# Altium project Volta_P0_Single_Port.PrjPcb (part 3 of 3)

## Sheet Fuel_Gauge.SchDoc
size A4
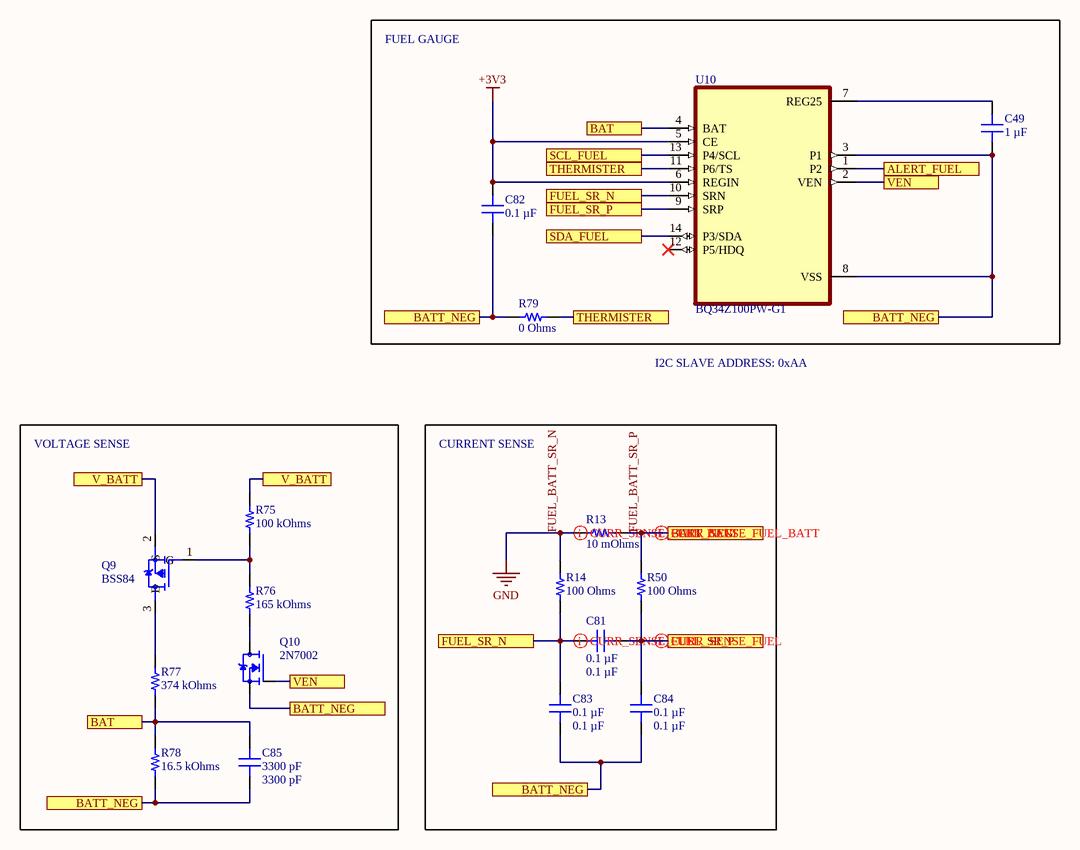
[diagram p4: Fuel_Gauge.SchDoc]

### Parts
C49  1 µF  [CAP 0402_1005]
C81  0.1 µF  [CAP 0603_1608]
C82  0.1 µF  [CAP 0402_1005]
C83  0.1 µF  [CAP 0603_1608]
C84  0.1 µF  [CAP 0603_1608]
C85  3300 pF  [CAP 0402_1005]
Q9  BSS84  [SOT95P240X120-3N]
Q10  2N7002  [SOT95P240X111-3N]
R13  10 mOhms  [RES 1210_3225]
R14  100 Ohms  [RES 0603_1608]
R50  100 Ohms  [RES 0603_1608]
R75  100 kOhms  [RES 0402_1005]
R76  165 kOhms  [RES 0402_1005]
R77  374 kOhms  [RES 0402_1005]
R78  16.5 kOhms  [RES 0603_1608]
R79  0 Ohms  [RES 0805_2012]
U10  BQ34Z100PW-G1  [SOP65P640X120-14N]

### Blocks framed on the sheet
FUEL GAUGE: C49 C82 R79 U10
VOLTAGE SENSE: C85 Q9 Q10 R75-R78
CURRENT SENSE: C81 C83 C84 R13 R14 R50

### Ports
ALERT_FUEL, BAT, BATT_NEG, FUEL_SR_N, FUEL_SR_P, SCL_FUEL, SDA_FUEL, THERMISTER, V_BATT, VEN

### Nets
+3V3: C82.2 U10.5(CE) U10.6(REGIN)
FUEL_BATT_SR_N: R13.1 R14.2  [also labelled GND]
ALERT_FUEL: U10.1(P2) ; port ALERT_FUEL
BAT: C85.2 R77.1 R78.2 U10.4(BAT) ; port BAT
FUEL_BATT_SR_P: C49.1 C82.1 C83.1 C84.1 C85.1 Q10.2(S) R13.2 R50.2 R78.1 R79.1 U10.3(P1) U10.8(VSS) ; port BATT_NEG
FUEL_SR_N: C81.2 C83.2 R14.1 U10.10(SRN) ; port FUEL_SR_N
FUEL_SR_P: C81.1 C84.2 R50.1 U10.9(SRP) ; port FUEL_SR_P
I2CS_SCL: U10.13(P4/SCL) ; port SCL_FUEL
I2CS_SDA: U10.14(P3/SDA) ; port SDA_FUEL
THERMISTER: R79.2 U10.11(P6/TS) ; port THERMISTER
V_BATT: Q9.2(S) R75.2 ; port V_BATT
VEN: Q10.1(G) U10.2(VEN) ; port VEN
NetC49_2: C49.2 U10.7(REG25)
NetQ9_1: Q9.1(G) R75.1 R76.2
NetQ9_3: Q9.3(D) R77.2
NetQ10_3: Q10.3(D) R76.1

Not connected (* = marked no-connect by the designer): U10 12(P5/HDQ)*

### Layout directives
differential pair; differential pair class CURR_SENSE_FUEL_BATT: FUEL_BATT_SR_N, FUEL_BATT_SR_P
differential pair; differential pair class CURR_SENSE_FUEL: FUEL_SR_N, FUEL_SR_P

### Notes on the sheet
- I2C SLAVE ADDRESS: 0xAA

### Library data of the parts
C49 = LMK105BJ105KPLF: CAP CER 1UF 10V X5R 0402; manufacturer: Taiyo Yuden; Tolerance: ±10%; Part Number: LMK105BJ105KPLF; Value: 1 µF; Applications: SMPS Filtering; Capacitance: 1 µF; componentlink1description: Datasheet; componentlink1url: https://ds.yuden.co.jp/TYCOMPAS/ut/detail?pn=LMK105BJ105KPLF &u=M; componentlink2description: DigiKey Link; componentlink2url: https://www.digikey.com/en/products/detail/taiyo-yuden/LMK105BJ105KPLF/7403744; Device Package: 0402 (1005 Metric); lastupdated: 9/08/2022 12:01:16 PM; Lifecycle Status: Active; Minimum Order: 1; Mounting Type: Surface Mount, MLCC; Operating Temperature: -55°C ~ 85°C; Package / Case: 0402 (1005 Metric); packaging: TapeAndReel; partid: 2328; Part Status: Active; price: 0.02; series: M; Size / Dimension: 0.039" L x 0.020" W (1.00mm x 0.50mm); Supplier 1: DigiKey; Supplier Part Number 1: 587-6274-1-ND; Temperature Coefficient: X5R; Thickness (Max): 0.026" (0.65mm); Voltage - Rated: 10V
C81 C83 C84 = C0603C104K5RAC7411: CAP CER 0.1UF 50V X7R 0603; manufacturer: KEMET; Tolerance: ±10%; Part Number: C0603C104K5RAC7411; Value: 0.1 µF; Applications: Bypass, Decoupling; Capacitance: 0.1 µF; componentlink1description: Datasheet; componentlink1url: https://api.kemet.com/component-edge/download/datasheet/C0603C104K5RAC7411.pdf; componentlink2description: DigiKey Link; componentlink2url: https://www.digikey.com/en/products/detail/kemet/C0603C104K5RAC7411/3317013; Device Package: 0603 (1608 Metric); lastupdated: 11/07/2023 7:07:50 PM; Lifecycle Status: Active; Minimum Order: 1; Mounting Type: Surface Mount, MLCC; Operating Temperature: -55°C ~ 125°C; Package / Case: 0603 (1608 Metric); packaging: TapeAndReel; partid: 2233; Part Status: Active; price: 0.01; series: SMD Comm X7R; Size / Dimension: 0.063" L x 0.031" W (1.60mm x 0.80mm); Supplier 1: DigiKey; Supplier Part Number 1: 399-C0603C104K5RAC7411CT-ND; Temperature Coefficient: X7R; Thickness (Max): 0.035" (0.90mm); Voltage - Rated: 50V
C82 = LMK105BJ104MC-F: CAP CER 0.1UF 10V X5R 0402; manufacturer: Taiyo Yuden; Tolerance: ±20%; Part Number: LMK105BJ104MC-F; Value: 0.1 µF; Applications: SMPS Filtering; Capacitance: 0.1 µF; componentlink1description: Datasheet; componentlink1url: https://www.yuden.co.jp/productdata/catalog/mlcc01_e.pdf; componentlink2description: DigiKey Link; componentlink2url: https://www.digikey.com/en/products/detail/taiyo-yuden/LMK105BJ104MC-F/6035743; Device Package: 0402 (1005 Metric); lastupdated: 9/08/2022 12:01:16 PM; Lifecycle Status: Active; Minimum Order: 1; Mounting Type: Surface Mount, MLCC; Operating Temperature: -55°C ~ 85°C; Package / Case: 0402 (1005 Metric); packaging: TapeAndReel; partid: 2414; Part Status: Active; price: 0.03; series: M; Size / Dimension: 0.039" L x 0.020" W (1.00mm x 0.50mm); Supplier 1: DigiKey; Supplier Part Number 1: 587-4572-1-ND; Temperature Coefficient: X5R; Thickness (Max): 0.009" (0.22mm); Voltage - Rated: 10V
C85 = AC0402KRX7R7BB332: CAP CER 3300PF 16V X7R 0402; manufacturer: Yageo; Tolerance: ±10%; Part Number: AC0402KRX7R7BB332; Value: 3300 pF; Applications: Automotive; Capacitance: 3300 pF; componentlink1description: Datasheet; componentlink1url: http://www.yageo.com/documents/recent/UPY-AC_NP0X7R_16V-to-630V_12.pdf; componentlink2description: DigiKey Link; componentlink2url: https://www.digikey.com/en/products/detail/yageo/AC0402KRX7R7BB332/6643254; Device Package: 0402 (1005 Metric); lastupdated: 11/07/2023 7:03:47 PM; Lifecycle Status: Active; Minimum Order: 1; Mounting Type: Surface Mount, MLCC; Operating Temperature: -55°C ~ 125°C; Package / Case: 0402 (1005 Metric); packaging: TapeAndReel; partid: 1886; Part Status: Active; price: 0.01; Ratings: AEC-Q200; series: AC; Size / Dimension: 0.039" L x 0.020" W (1.00mm x 0.50mm); Supplier 1: DigiKey; Supplier Part Number 1: 311-3268-1-ND; Temperature Coefficient: X7R; Thickness (Max): 0.022" (0.55mm); Voltage - Rated: 16V
Q9 = BSS84: BSS84 Series 50 V 10 Ohms P-Ch Enhancement Mode Field Effect Transistor SOT-23-3; MF: {'manufacturer': u'ON Semiconductor'}; Package: None; Price: None; Value: *; MP: BSS84; Availability: Unavailable
Q10 = 2N7002: N-Channel 60V 280mA (Ta) 350mW (Ta) Surface Mount SOT-23-3 (TO-236); MF: {'manufacturer': u'NTE Electronics, Inc'}; Package: None; Price: None; Value: *; MP: 2N7002; Availability: Unavailable
R13 = RL1210FR-070R01L: RES 0.01 OHM 1% 1/2W 1210; Manufacturer: Yageo; Power (Watts): 0.5W, 1/2W; Temperature Coefficient: ±1500ppm/°C; Part Number: RL1210FR-070R01L; ComponentLink1Description: Datasheet; ComponentLink1URL: http://www.yageo.com/documents/recent/PYu-RL_Group_521_RoHS_L_2.pdf; ComponentLink2Description: DigiKey Link; ComponentLink2URL: https://www.digikey.com/en/products/detail/yageo/RL1210FR-070R01L/3886087; Composition: Thick Film; Device Package: 1210 (3225 Metric); Features: Automotive AEC-Q200, Current Sense, Moisture Resistant; Height - Seated (Max): 0.026" (0.65mm); LastUpdated: 12/07/2023 8:34:03 PM; Lifecycle Status: Active; Minimum Order: 1; Number of Terminations: 2; Operating Temperature: -55°C ~ 155°C; Package / Case: 1210 (3225 Metric); Packaging: TapeAndReel; Part Status: Active; Price: 0.11; Ratings: AEC-Q200; Resistance: 10 mOhms; Series: RL; Size / Dimension: 0.122" L x 0.102" W (3.10mm x 2.60mm); Supplier 1: DigiKey; Supplier Part Number 1: 311-0.01NACT-ND; Supplier Device Package: 1210; Tolerance: ±1%; Value: 10 mOhms
R14 R50 = ERA-3AEB101V: RES SMD 100 OHM 0.1% 1/10W 0603; Manufacturer: Panasonic Electronic Components; Power (Watts): 0.1W, 1/10W; Temperature Coefficient: ±25ppm/°C; Part Number: ERA-3AEB101V; Value: 100 Ohms; ComponentLink1Description: Datasheet; ComponentLink1URL: https://industrial.panasonic.com/cdbs/www-data/pdf/RDM0000/AOA0000C307.pdf; ComponentLink2Description: DigiKey Link; ComponentLink2URL: https://www.digikey.com/en/products/detail/panasonic-electronic-components/ERA-3AEB101V/1465830; Composition: Thin Film; Device Package: 0603 (1608 Metric); Features: Automotive AEC-Q200; Height - Seated (Max): 0.022" (0.55mm); LastUpdated: 11/07/2023 7:34:29 PM; Lifecycle Status: Active; Minimum Order: 1; Number of Terminations: 2; Operating Temperature: -55°C ~ 155°C; Package / Case: 0603 (1608 Metric); Packaging: TapeAndReel; PartId: 5523; Part Status: Active; Price: 0.03; Ratings: AEC-Q200; Resistance: 100 Ohms; Series: ERA-3A; Size / Dimension: 0.063" L x 0.031" W (1.60mm x 0.80mm); Supplier 1: DigiKey; Supplier Part Number 1: P100DBCT-ND; Supplier Device Package: 0603; Tolerance: ±0.1%
R75 = RP73PF1E100KBTD: RES 100K OHM 0.1% 1/10W 0402; Manufacturer: TE Connectivity Passive Product; Power (Watts): 0.1W, 1/10W; Temperature Coefficient: ±25ppm/°C; Part Number: RP73PF1E100KBTD; Value: 100 kOhms; ComponentLink1Description: Datasheet; ComponentLink1URL: https://www.te.com/commerce/DocumentDelivery/DDEController?Action=srchrtrv&DocNm=1773272&DocType=DS&DocLang=English; ComponentLink2Description: DigiKey Link; ComponentLink2URL: https://www.digikey.com/en/products/detail/te-connectivity-passive-product/RP73PF1E100KBTD/8261053; Composition: Thin Film; Device Package: 0402 (1005 Metric); Height - Seated (Max): 0.014" (0.35mm); LastUpdated: 12/07/2023 7:24:29 PM; Lifecycle Status: Active; Minimum Order: 1; Number of Terminations: 2; Operating Temperature: -55°C ~ 155°C; Package / Case: 0402 (1005 Metric); Packaging: TapeAndReel; PartId: 2436; Part Status: Active; Price: 0.08; Resistance: 100 kOhms; Series: RP73, Holsworthy; Size / Dimension: 0.039" L x 0.020" W (1.00mm x 0.50mm); Supplier 1: DigiKey; Supplier Part Number 1: A127511CT-ND; Supplier Device Package: 0402; Tolerance: ±0.1%
R76 = RP73PF1E165KBTD: RES 165K OHM 0.1% 1/10W 0402; Manufacturer: TE Connectivity Passive Product; Power (Watts): 0.1W, 1/10W; Temperature Coefficient: ±25ppm/°C; Part Number: RP73PF1E165KBTD; Value: 165 kOhms; ComponentLink1Description: Datasheet; ComponentLink1URL: https://www.te.com/commerce/DocumentDelivery/DDEController?Action=srchrtrv&DocNm=1773272&DocType=DS&DocLang=English; ComponentLink2Description: DigiKey Link; ComponentLink2URL: https://www.digikey.com/en/products/detail/te-connectivity-passive-product/RP73PF1E165KBTD/8261074; Composition: Thin Film; Device Package: 0402 (1005 Metric); Height - Seated (Max): 0.014" (0.35mm); LastUpdated: 12/07/2023 7:24:29 PM; Lifecycle Status: Active; Minimum Order: 1; Number of Terminations: 2; Operating Temperature: -55°C ~ 155°C; Package / Case: 0402 (1005 Metric); Packaging: TapeAndReel; PartId: 2420; Part Status: Active; Price: 0.08; Resistance: 165 kOhms; Series: RP73, Holsworthy; Size / Dimension: 0.039" L x 0.020" W (1.00mm x 0.50mm); Supplier 1: DigiKey; Supplier Part Number 1: A127532CT-ND; Supplier Device Package: 0402; Tolerance: ±0.1%
R77 = ERJ-2RKF3743X: RES SMD 374K OHM 1% 1/10W 0402; Manufacturer: Panasonic Electronic Components; Power (Watts): 0.1W, 1/10W; Temperature Coefficient: ±100ppm/°C; Part Number: ERJ-2RKF3743X; Value: 374 kOhms; ComponentLink1Description: Datasheet; ComponentLink1URL: https://industrial.panasonic.com/cdbs/www-data/pdf/RDA0000/AOA0000C304.pdf; ComponentLink2Description: DigiKey Link; ComponentLink2URL: https://www.digikey.com/en/products/detail/panasonic-electronic-components/ERJ-2RKF3743X/192327; Composition: Thick Film; Device Package: 0402 (1005 Metric); Features: Automotive AEC-Q200; Height - Seated (Max): 0.016" (0.40mm); LastUpdated: 12/07/2023 7:24:13 PM; Lifecycle Status: Active; Minimum Order: 1; Number of Terminations: 2; Operating Temperature: -55°C ~ 155°C; Package / Case: 0402 (1005 Metric); Packaging: CutTape; PartId: 6416; Part Status: Active; Price: 0.01; Ratings: AEC-Q200; Resistance: 374 kOhms; Series: ERJ-2RK; Size / Dimension: 0.039" L x 0.020" W (1.00mm x 0.50mm); Supplier 1: DigiKey; Supplier Part Number 1: P374KLCT-ND; Supplier Device Package: 0402; Tolerance: ±1%
R78 = 1-2176089-8: RES SMD 16.5K OHM 0.1% 1/6W 0603; Manufacturer: TE Connectivity Passive Product; Power (Watts): 0.167W, 1/6W; Temperature Coefficient: ±25ppm/°C; Part Number: 1-2176089-8; Value: 16.5 kOhms; ComponentLink1Description: Datasheet; ComponentLink1URL: https://www.te.com/commerce/DocumentDelivery/DDEController?Action=srchrtrv&DocNm=1773272&DocType=DS&DocLang=English; ComponentLink2Description: DigiKey Link; ComponentLink2URL: https://www.digikey.com/en/products/detail/te-connectivity-passive-product/1-2176089-8/4033693; Composition: Thin Film; Device Package: 0603 (1608 Metric); Height - Seated (Max): 0.022" (0.55mm); LastUpdated: 11/07/2023 7:34:02 PM; Lifecycle Status: Active; Minimum Order: 1; Number of Terminations: 2; Operating Temperature: -55°C ~ 155°C; Package / Case: 0603 (1608 Metric); Packaging: TapeAndReel; PartId: 11782; Part Status: Active; Price: 0.14; Resistance: 16.5 kOhms; Series: RP73P, Holsworthy; Size / Dimension: 0.061" L x 0.031" W (1.55mm x 0.80mm); Supplier 1: DigiKey; Supplier Part Number 1: A110225CT-ND; Supplier Device Package: 0603; Tolerance: ±0.1%
R79 = JR0805X35E: 0805 35 AMP JUMPER; Manufacturer: Ohmite; Power (Watts): 0.245W; Part Number: JR0805X35E; Value: 0 Ohms; ComponentLink1Description: Datasheet; ComponentLink1URL: https://www.ohmite.com/assets/docs/res_jr.pdf?r=false; ComponentLink2Description: DigiKey Link; ComponentLink2URL: https://www.digikey.com/en/products/detail/ohmite/JR0805X35E/10233372; Composition: Metal Element; Device Package: 0805 (2012 Metric); Height - Seated (Max): 0.022" (0.55mm); LastUpdated: 12/07/2023 7:52:18 PM; Lifecycle Status: Active; Minimum Order: 1; Number of Terminations: 2; Operating Temperature: -55°C ~ 150°C; Package / Case: 0805 (2012 Metric); Packaging: TapeAndReel; PartId: 29311; Part Status: Active; Price: 0.10; Resistance: 0 Ohms; Series: JR; Size / Dimension: 0.079" L x 0.049" W (2.00mm x 1.25mm); Supplier 1: DigiKey; Supplier Part Number 1: JR0805X35ECT-ND; Supplier Device Package: 0805; Tolerance: Jumper
U10 = BQ34Z100PW-G1: MF: {'manufacturer': u'Texas Instruments'}; Package: None; Price: None; Value: *; MP: BQ34Z100PW-G1; Availability: Unavailable

## Sheet Voltage_Regulation_TI.SchDoc
size A4
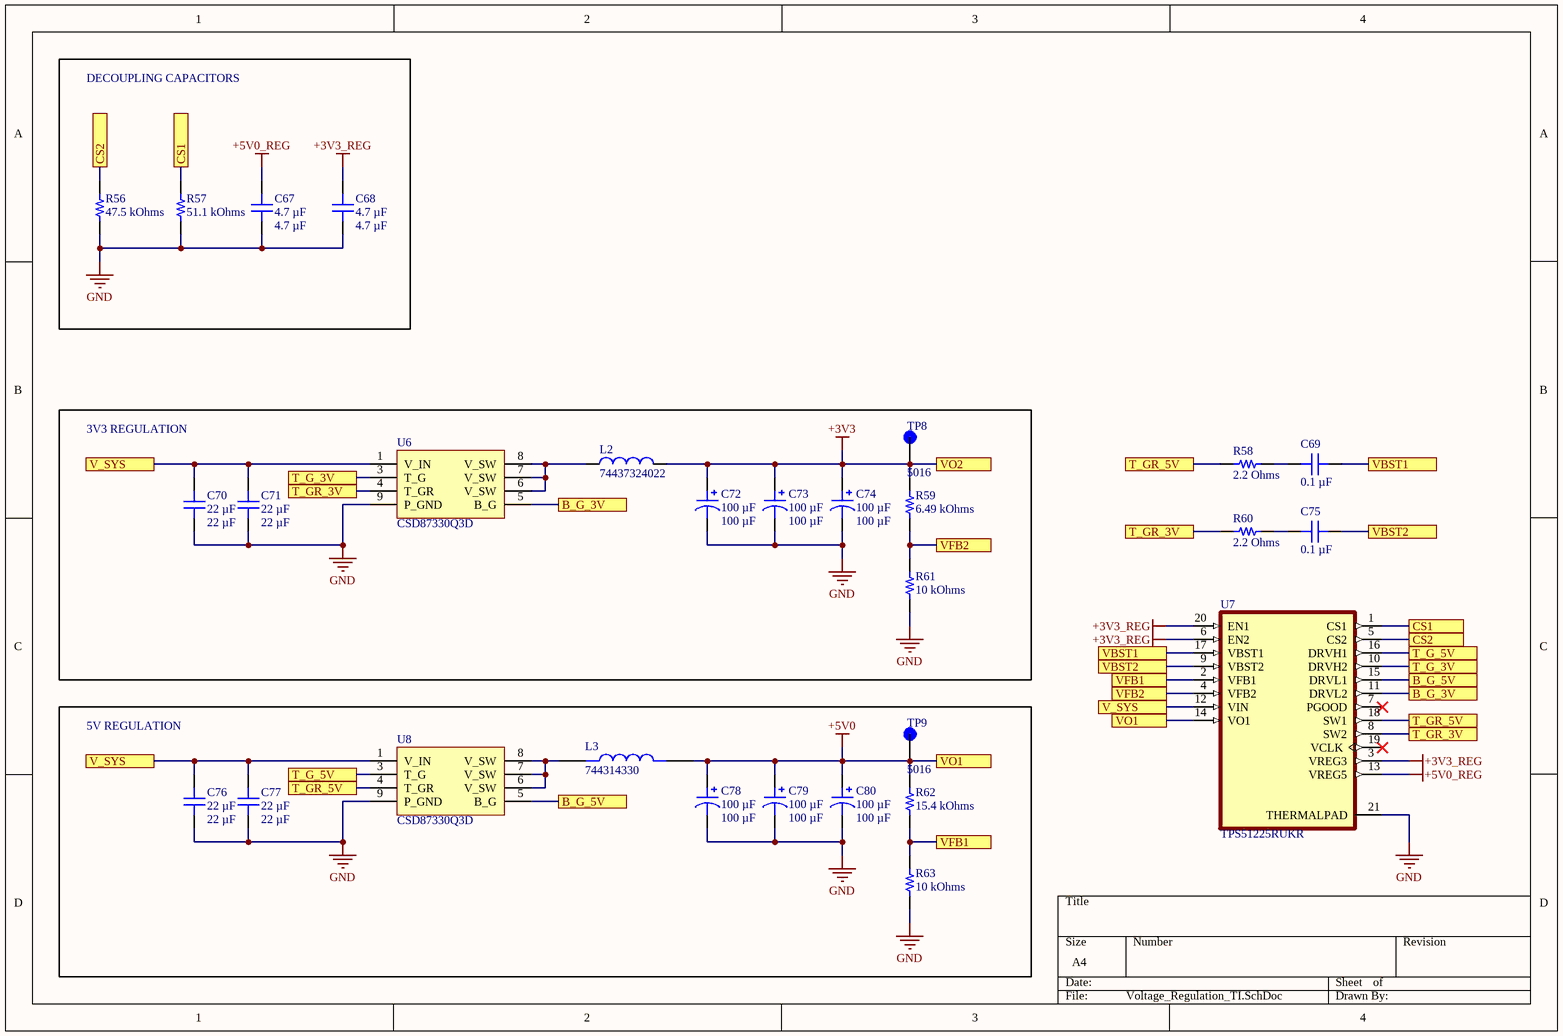
[diagram p5: Voltage_Regulation_TI.SchDoc]

### Parts
C67  4.7 µF  [CAP 0402_1005]
C68  4.7 µF  [CAP 0402_1005]
C69  0.1 µF  [CAP 0402_1005]
C70  22 µF  [CAP 0805_2012]
C71  22 µF  [CAP 0805_2012]
C72  100 µF  [CAP POL 1411_3528]
C73  100 µF  [CAP POL 1411_3528]
C74  100 µF  [CAP POL 1411_3528]
C75  0.1 µF  [CAP 0402_1005]
C76  22 µF  [CAP 0805_2012]
C77  22 µF  [CAP 0805_2012]
C78  100 µF  [CAP POL 1411_3528]
C79  100 µF  [CAP POL 1411_3528]
C80  100 µF  [CAP POL 1411_3528]
L2  74437324022  [IND_74437324022]
L3  744314330  [IND_744314330]
R56  47.5 kOhms  [RES 0402_1005]
R57  51.1 kOhms  [RES 0402_1005]
R58  2.2 Ohms  [RES 0402_1005]
R59  6.49 kOhms  [RES 0402_1005]
R60  2.2 Ohms  [RES 0402_1005]
R61  10 kOhms  [RES 0402_1005]
R62  15.4 kOhms  [RES 0402_1005]
R63  10 kOhms  [RES 0402_1005]
TP8  5016  [KEYSTONE_5016]  (no BOM)
TP9  5016  [KEYSTONE_5016]  (no BOM)
U6  CSD87330Q3D  [Q3D]
U7  TPS51225RUKR  [QFN40P300X300X80-21N]
U8  CSD87330Q3D  [Q3D]

### Blocks framed on the sheet
DECOUPLING CAPACITORS: C67 C68 R56 R57
3V3 REGULATION: C70-C74 L2 R59 R61 TP8 U6
5V REGULATION: C76-C80 L3 R62 R63 TP9 U8

### Ports
B_G_3V, B_G_5V, CS1, CS2, T_G_3V, T_G_5V, T_GR_3V, T_GR_5V, V_SYS, VBST1, VBST2, VFB1, VFB2, VO1, VO2

### Nets
+3V3: C72.1 C73.1 C74.1 L2.2 R59.2 TP8.TP ; port VO2
+3V3_REG: C68.2 U7.3(VREG3) U7.6(EN2) U7.20(EN1)
+5V0: C78.1 C79.1 C80.1 L3.2 R62.2 TP9.TP U7.14(VO1) ; port VO1
+5V0_REG: C67.2 U7.13(VREG5)
GND: C67.1 C68.1 C70.1 C71.1 C72.2 C73.2 C74.2 C76.1 C77.1 C78.2 C79.2 C80.2 R56.1 R57.1 R61.2 R63.2 U6.9(P_GND) U7.21(THERMALPAD) U8.9(P_GND)  [project net FUEL_BATT_SR_N]
B_G_3V: U6.5(B_G) U7.11(DRVL2) ; port B_G_3V
B_G_5V: U7.15(DRVL1) U8.5(B_G) ; port B_G_5V
CS1: R57.2 U7.1(CS1) ; port CS1
CS2: R56.2 U7.5(CS2) ; port CS2
T_G_3V: U6.3(T_G) U7.10(DRVH2) ; port T_G_3V
T_G_5V: U7.16(DRVH1) U8.3(T_G) ; port T_G_5V
T_GR_3V: R60.1 U6.4(T_GR) U7.8(SW2) ; port T_GR_3V
T_GR_5V: R58.1 U7.18(SW1) U8.4(T_GR) ; port T_GR_5V
V_SYS: C70.2 C71.2 C76.2 C77.2 U6.1(V_IN) U7.12(VIN) U8.1(V_IN) ; port V_SYS
VBST1: C69.1 U7.17(VBST1) ; port VBST1
VBST2: C75.1 U7.9(VBST2) ; port VBST2
VFB1: R62.1 R63.1 U7.2(VFB1) ; port VFB1
VFB2: R59.1 R61.1 U7.4(VFB2) ; port VFB2
NetC69_2: C69.2 R58.2
NetC75_2: C75.2 R60.2
NetL2_1: L2.1 U6.6(V_SW) U6.7(V_SW) U6.8(V_SW)
NetL3_1: L3.1 U8.6(V_SW) U8.7(V_SW) U8.8(V_SW)

Not connected (* = marked no-connect by the designer): U7 7(PGOOD)* 19(VCLK)*

### Library data of the parts
C67 C68 = CL05A475MO5NUNC: CAP CER 4.7UF 16V X5R 0402; manufacturer: Samsung Electro-Mechanics; Tolerance: ±20%; Part Number: CL05A475MO5NUNC; Value: 4.7 µF; Applications: General Purpose; Capacitance: 4.7 µF; componentlink1description: Datasheet; componentlink1url: http://www.samsungsem.com/kr/support/product-search/mlcc/__icsFiles/afieldfile/2019/05/29/Data%20sheet_CL05A475MO5NUNC.pdf; componentlink2description: DigiKey Link; componentlink2url: https://www.digikey.com/en/products/detail/samsung-electro-mechanics/CL05A475MO5NUNC/5961320; Device Package: 0402 (1005 Metric); lastupdated: 27/04/2023 7:05:02 PM; Lifecycle Status: Active; Minimum Order: 1; Mounting Type: Surface Mount, MLCC; Operating Temperature: -55°C ~ 85°C; Package / Case: 0402 (1005 Metric); packaging: TapeAndReel; partid: 1760; Part Status: Active; price: 0.08; series: CL; Size / Dimension: 0.039" L x 0.020" W (1.00mm x 0.50mm); Supplier 1: DigiKey; Supplier Part Number 1: 1276-6836-1-ND; Temperature Coefficient: X5R; Thickness (Max): 0.028" (0.70mm); Voltage - Rated: 16V
C69 C75 = 885012105001: CAP CER 0.1UF 6.3V X5R 0402; manufacturer: Würth Elektronik; Tolerance: ±20%; Part Number: 885012105001; Value: 0.1 µF; Applications: General Purpose; Capacitance: 0.1 µF; componentlink1description: Datasheet; componentlink1url: https://katalog.we-online.de/pbs/datasheet/885012105001.pdf; componentlink2description: DigiKey Link; componentlink2url: https://www.digikey.com/en/products/detail/würth-elektronik/885012105001/5453333; Device Package: 0402 (1005 Metric); lastupdated: 26/04/2023 7:02:37 PM; Lifecycle Status: Active; Minimum Order: 1; Mounting Type: Surface Mount, MLCC; Operating Temperature: -55°C ~ 85°C; Package / Case: 0402 (1005 Metric); packaging: TapeAndReel; partid: 1931; Part Status: Active; price: 0.01; series: WCAP-CSGP; Size / Dimension: 0.039" L x 0.020" W (1.00mm x 0.50mm); Supplier 1: DigiKey; Supplier Part Number 1: 732-7478-1-ND; Temperature Coefficient: X5R; Thickness (Max): 0.022" (0.55mm); Voltage - Rated: 6.3V
C70 C71 C76 C77 = C2012X5R1V226M125AC: CAP CER 22UF 35V X5R 0805; manufacturer: TDK Corporation; Tolerance: ±20%; Part Number: C2012X5R1V226M125AC; Value: 22 µF; Applications: General Purpose; Capacitance: 22 µF; componentlink1description: Datasheet; componentlink1url: https://product.tdk.com/info/en/catalog/datasheets/mlcc_commercial_general_en.pdf?ref_disty=digikey; componentlink2description: DigiKey Link; componentlink2url: https://www.digikey.com/en/products/detail/tdk-corporation/C2012X5R1V226M125AC/3951664; Device Package: 0805 (2012 Metric); Features: Low ESL; lastupdated: 27/04/2023 7:13:26 PM; Lifecycle Status: Active; Minimum Order: 1; Mounting Type: Surface Mount, MLCC; Operating Temperature: -55°C ~ 85°C; Package / Case: 0805 (2012 Metric); packaging: TapeAndReel; partid: 45365; Part Status: Active; price: 0.28; series: C; Size / Dimension: 0.079" L x 0.049" W (2.00mm x 1.25mm); Supplier 1: DigiKey; Supplier Part Number 1: 445-14428-1-ND; Temperature Coefficient: X5R; Thickness (Max): 0.057" (1.45mm); Voltage - Rated: 35V
C72-C74 C78-C80 = ATCC-211B-010-107M-T: CAP TANT 100UF 20% 10V 1411; manufacturer: Abracon LLC; Manufacturer Size Code: B; ESR (Equivalent Series Resistance): 1.5Ohm; Type: Molded; Part Number: ATCC-211B-010-107M-T; Value: 100 µF; Capacitance: 100 µF; componentlink1description: Datasheet; componentlink1url: https://abracon.com/Magnetics/inductors/ATCC-211.pdf; componentlink2description: DigiKey Link; componentlink2url: https://www.digikey.com/en/products/detail/abracon-llc/ATCC-211B-010-107M-T/4245645; Device Package: 1411 (3528 Metric); Features: General Purpose; Height - Seated (Max): 0.083" (2.10mm); lastupdated: 27/04/2023 7:52:12 PM; Lifecycle Status: Active; Minimum Order: 1; Mounting Type: Surface Mount; Operating Temperature: -55°C ~ 125°C; Package / Case: 1411 (3528 Metric); packaging: TapeAndReel; partid: 25; Part Status: Active; price: 0.45; series: ATCC-211; Size / Dimension: 0.138" L x 0.110" W (3.50mm x 2.80mm); Supplier 1: DigiKey; Supplier Part Number 1: ATCC-211B-010-107M-TCT-ND; Tolerance: ±20%; Voltage - Rated: 10 V
L2 = 74437324022: LHMI Inductor 4020 2.2uH 5.0A 27.0mOhm; MF: {'manufacturer': u'W\xfcrth Elektronik'}; Value: 2.2µH; Availability: Unavailable; Price: None; MP: 74437324022; Package: None
L3 = 744314330: Inductor SMD 7050 3.3µH 9 A Wuerth Elektronik WE-HCI 744314330 1 pc(s); MF: {'manufacturer': u'Wurth Electronics'}; MP: 744314330; Value: 3.3µH; Package: None; Price: None; Availability: Unavailable
R56 = RC0402FR-0747K5L: RES 47.5K OHM 1% 1/16W 0402; Manufacturer: Yageo; Power (Watts): 0.063W, 1/16W; Temperature Coefficient: ±100ppm/°C; Part Number: RC0402FR-0747K5L; Value: 47.5 kOhms; ComponentLink1Description: Datasheet; ComponentLink1URL: https://www.yageo.com/upload/media/product/productsearch/datasheet/rchip/PYu-RC_Group_51_RoHS_L_10.pdf; ComponentLink2Description: DigiKey Link; ComponentLink2URL: https://www.digikey.com/en/products/detail/yageo/RC0402FR-0747K5L/726617; Composition: Thick Film; Device Package: 0402 (1005 Metric); Features: Moisture Resistant; Height - Seated (Max): 0.016" (0.40mm); LastUpdated: 27/04/2023 7:26:05 PM; Lifecycle Status: Active; Minimum Order: 1; Number of Terminations: 2; Operating Temperature: -55°C ~ 155°C; Package / Case: 0402 (1005 Metric); Packaging: CutTape; PartId: 2538; Part Status: Active; Price: 0.01; Resistance: 47.5 kOhms; Series: RC_L; Size / Dimension: 0.039" L x 0.020" W (1.00mm x 0.50mm); Supplier 1: DigiKey; Supplier Part Number 1: 311-47.5KLRCT-ND; Supplier Device Package: 0402; Tolerance: ±1%
R57 = CR0402-FX-5112GLF: RES SMD 51.1K OHM 1% 1/16W 0402; Manufacturer: Bourns Inc.; Power (Watts): 0.063W, 1/16W; Temperature Coefficient: ±100ppm/°C; Part Number: CR0402-FX-5112GLF; Value: 51.1 kOhms; ComponentLink1Description: Datasheet; ComponentLink1URL: https://www.bourns.com/docs/Product-Datasheets/CR0402.pdf; ComponentLink2Description: DigiKey Link; ComponentLink2URL: https://www.digikey.com/en/products/detail/bourns-inc/CR0402-FX-5112GLF/3783414; Composition: Thick Film; Device Package: 0402 (1005 Metric); Height - Seated (Max): 0.016" (0.40mm); LastUpdated: 27/04/2023 7:25:58 PM; Lifecycle Status: Active; Minimum Order: 1; Number of Terminations: 2; Operating Temperature: -55°C ~ 155°C; Package / Case: 0402 (1005 Metric); Packaging: CutTape; PartId: 4388; Part Status: Active; Price: 0.01; Resistance: 51.1 kOhms; Series: CR0402; Size / Dimension: 0.039" L x 0.020" W (1.00mm x 0.50mm); Supplier 1: DigiKey; Supplier Part Number 1: CR0402-FX-5112GLFCT-ND; Supplier Device Package: 0402; Tolerance: ±1%
R58 R60 = RC0402JR-072R2L: RES 2.2 OHM 5% 1/16W 0402; Manufacturer: Yageo; Power (Watts): 0.063W, 1/16W; Temperature Coefficient: ±200ppm/°C; Part Number: RC0402JR-072R2L; Value: 2.2 Ohms; ComponentLink1Description: Datasheet; ComponentLink1URL: https://www.yageo.com/upload/media/product/productsearch/datasheet/rchip/PYu-RC_Group_51_RoHS_L_10.pdf; ComponentLink2Description: DigiKey Link; ComponentLink2URL: https://www.digikey.com/en/products/detail/yageo/RC0402JR-072R2L/726435; Composition: Thick Film; Device Package: 0402 (1005 Metric); Features: Moisture Resistant; Height - Seated (Max): 0.016" (0.40mm); LastUpdated: 27/04/2023 7:26:02 PM; Lifecycle Status: Active; Minimum Order: 1; Number of Terminations: 2; Operating Temperature: -55°C ~ 155°C; Package / Case: 0402 (1005 Metric); Packaging: CutTape; PartId: 3413; Part Status: Active; Price: 0.01; Resistance: 2.2 Ohms; Series: RC_L; Size / Dimension: 0.039" L x 0.020" W (1.00mm x 0.50mm); Supplier 1: DigiKey; Supplier Part Number 1: 311-2.2JRCT-ND; Supplier Device Package: 0402; Tolerance: ±5%
R59 = RC0402FR-076K49L: RES 6.49K OHM 1% 1/16W 0402; Manufacturer: Yageo; Power (Watts): 0.063W, 1/16W; Temperature Coefficient: ±100ppm/°C; Part Number: RC0402FR-076K49L; Value: 6.49 kOhms; ComponentLink1Description: Datasheet; ComponentLink1URL: https://www.yageo.com/upload/media/product/productsearch/datasheet/rchip/PYu-RC_Group_51_RoHS_L_10.pdf; ComponentLink2Description: DigiKey Link; ComponentLink2URL: https://www.digikey.com/en/products/detail/yageo/RC0402FR-076K49L/726641; Composition: Thick Film; Device Package: 0402 (1005 Metric); Features: Moisture Resistant; Height - Seated (Max): 0.016" (0.40mm); LastUpdated: 27/04/2023 7:26:05 PM; Lifecycle Status: Active; Minimum Order: 1; Number of Terminations: 2; Operating Temperature: -55°C ~ 155°C; Package / Case: 0402 (1005 Metric); Packaging: CutTape; PartId: 2571; Part Status: Active; Price: 0.01; Resistance: 6.49 kOhms; Series: RC_L; Size / Dimension: 0.039" L x 0.020" W (1.00mm x 0.50mm); Supplier 1: DigiKey; Supplier Part Number 1: 311-6.49KLRCT-ND; Supplier Device Package: 0402; Tolerance: ±1%
R61 R63 = RC0402JR-1310KL: RES 10K OHM 5% 1/16W 0402; Manufacturer: Yageo; Power (Watts): 0.063W, 1/16W; Temperature Coefficient: ±100ppm/°C; Part Number: RC0402JR-1310KL; Value: 10 kOhms; ComponentLink1Description: Datasheet; ComponentLink1URL: https://www.yageo.com/upload/media/product/productsearch/datasheet/rchip/PYu-RC_Group_51_RoHS_L_11.pdf; ComponentLink2Description: DigiKey Link; ComponentLink2URL: https://www.digikey.com/en/products/detail/yageo/RC0402JR-1310KL/13694115; Composition: Thick Film; Device Package: 0402 (1005 Metric); Features: Moisture Resistant; Height - Seated (Max): 0.016" (0.40mm); LastUpdated: 4/04/2023 7:21:31 PM; Lifecycle Status: Active; Minimum Order: 50000; Number of Terminations: 2; Operating Temperature: -55°C ~ 155°C; Package / Case: 0402 (1005 Metric); PartId: 69237; Part Status: Active; Price: 0; Resistance: 10 kOhms; Series: RC_L; Size / Dimension: 0.039" L x 0.020" W (1.00mm x 0.50mm); Supplier 1: DigiKey; Supplier Part Number 1: 13-RC0402JR-1310KLTR-ND; Supplier Device Package: 0402; Tolerance: ±5%
R62 = RC0402FR-0715K4L: RES 15.4K OHM 1% 1/16W 0402; Manufacturer: Yageo; Power (Watts): 0.063W, 1/16W; Temperature Coefficient: ±100ppm/°C; Part Number: RC0402FR-0715K4L; Value: 15.4 kOhms; ComponentLink1Description: Datasheet; ComponentLink1URL: https://www.yageo.com/upload/media/product/productsearch/datasheet/rchip/PYu-RC_Group_51_RoHS_L_10.pdf; ComponentLink2Description: DigiKey Link; ComponentLink2URL: https://www.digikey.com/en/products/detail/yageo/RC0402FR-0715K4L/5280852; Composition: Thick Film; Device Package: 0402 (1005 Metric); Features: Moisture Resistant; Height - Seated (Max): 0.016" (0.40mm); LastUpdated: 27/04/2023 7:26:05 PM; Lifecycle Status: Active; Minimum Order: 1; Number of Terminations: 2; Operating Temperature: -55°C ~ 155°C; Package / Case: 0402 (1005 Metric); Packaging: CutTape; PartId: 2575; Part Status: Active; Price: 0.01; Resistance: 15.4 kOhms; Series: RC_L; Size / Dimension: 0.039" L x 0.020" W (1.00mm x 0.50mm); Supplier 1: DigiKey; Supplier Part Number 1: YAG2992CT-ND; Supplier Device Package: 0402; Tolerance: ±1%
TP8 TP9 = 5016: MF: {'manufacturer': u'Keystone Electronics'}; Package: None; MP: 5016; Value: *; Price: None; Availability: Unavailable
U6 U8 = CSD87330Q3D: Synchronous Buck NexFET™ Power Block
U7 = TPS51225RUKR: MF: {'manufacturer': u'Texas Instruments'}; Package: None; MP: TPS51225RUKR; Value: *; Price: None; Availability: Unavailable

## Sheet I2C.SchDoc
size A4
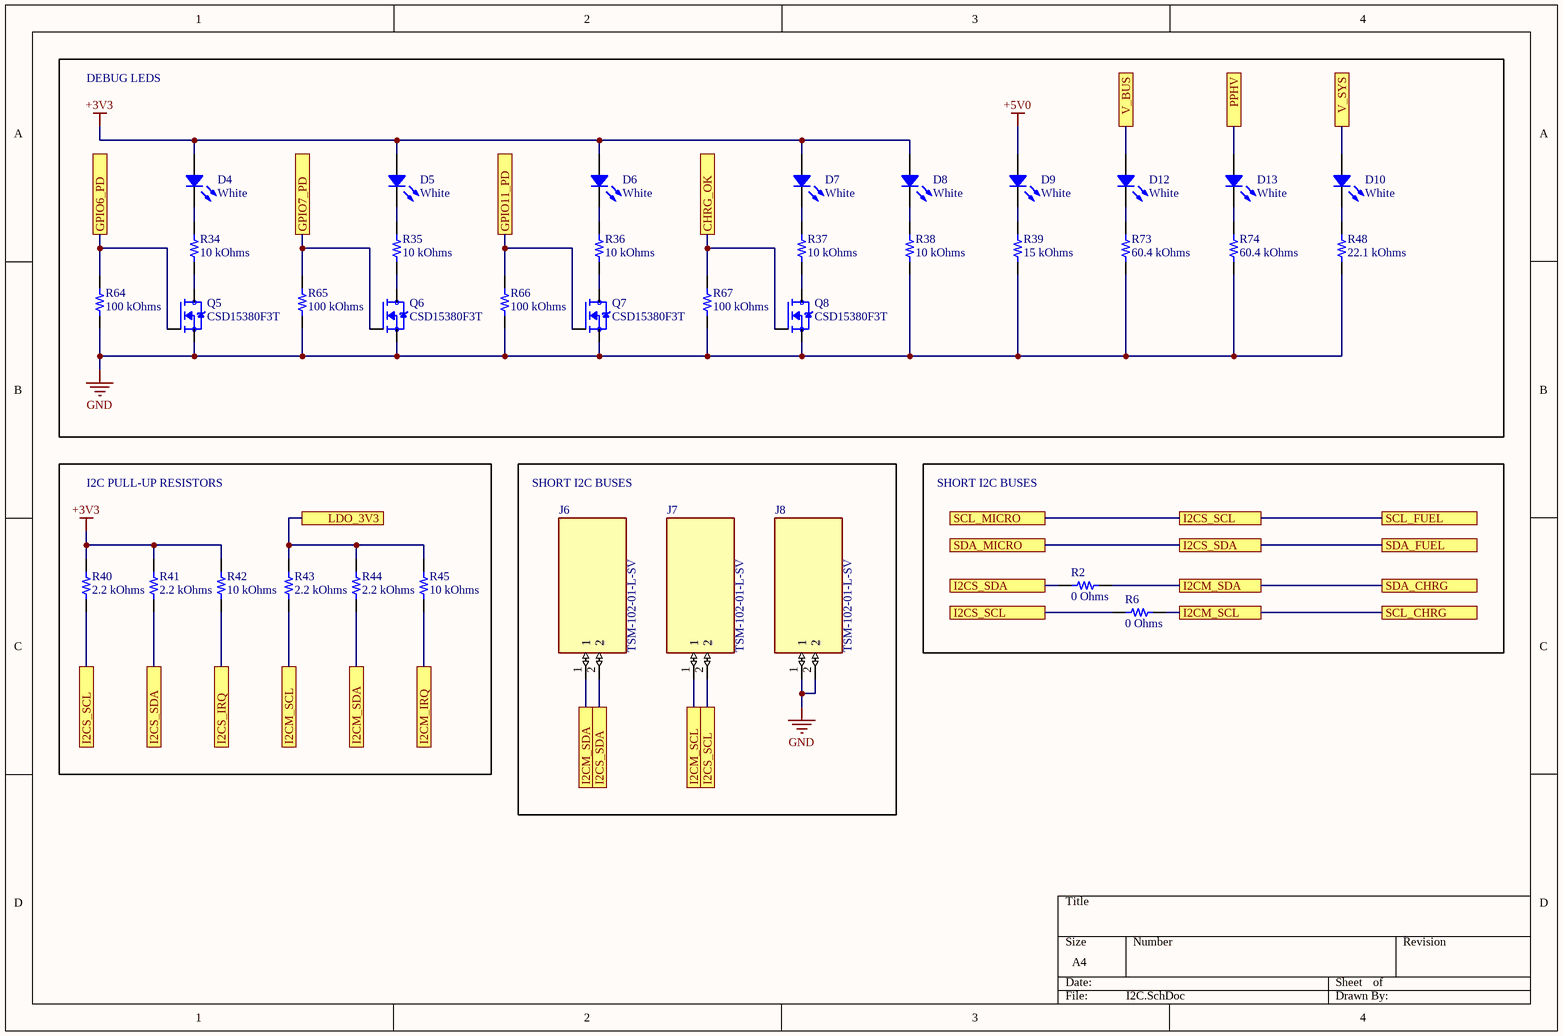
[diagram p6: I2C.SchDoc]

### Parts
D4  White  [LED 0805_2012]  (no BOM)
D5  White  [LED 0805_2012]  (no BOM)
D6  White  [LED 0805_2012]  (no BOM)
D7  White  [LED 0805_2012]  (no BOM)
D8  White  [LED 0805_2012]  (no BOM)
D9  White  [LED 0805_2012]  (no BOM)
D10  White  [LED 0805_2012]  (no BOM)
D12  White  [LED 0805_2012]  (no BOM)
D13  White  [LED 0805_2012]  (no BOM)
J6  TSM-102-01-L-SV  [TSM-102-01-L-SV]  (no BOM)
J7  TSM-102-01-L-SV  [TSM-102-01-L-SV]  (no BOM)
J8  TSM-102-01-L-SV  [TSM-102-01-L-SV]  (no BOM)
Q5  CSD15380F3T  [TRXDFN69X60X35-3N]  (no BOM)
Q6  CSD15380F3T  [TRXDFN69X60X35-3N]  (no BOM)
Q7  CSD15380F3T  [TRXDFN69X60X35-3N]  (no BOM)
Q8  CSD15380F3T  [TRXDFN69X60X35-3N]  (no BOM)
R2  0 Ohms  [RES 0402_1005]
R6  0 Ohms  [RES 0402_1005]
R34  10 kOhms  [RES 0603_1608]  (no BOM)
R35  10 kOhms  [RES 0603_1608]  (no BOM)
R36  10 kOhms  [RES 0603_1608]  (no BOM)
R37  10 kOhms  [RES 0603_1608]  (no BOM)
R38  10 kOhms  [RES 0603_1608]  (no BOM)
R39  15 kOhms  [RES 0402_1005]  (no BOM)
R40  2.2 kOhms  [RES 0402_1005]
R41  2.2 kOhms  [RES 0402_1005]
R42  10 kOhms  [RES 0402_1005]
R43  2.2 kOhms  [RES 0402_1005]
R44  2.2 kOhms  [RES 0402_1005]
R45  10 kOhms  [RES 0402_1005]
R48  22.1 kOhms  [RES 0603_1608]  (no BOM)
R64  100 kOhms  [RES 0402_1005]  (no BOM)
R65  100 kOhms  [RES 0402_1005]  (no BOM)
R66  100 kOhms  [RES 0402_1005]  (no BOM)
R67  100 kOhms  [RES 0402_1005]  (no BOM)
R73  60.4 kOhms  [RES 0603_1608]  (no BOM)
R74  60.4 kOhms  [RES 0603_1608]  (no BOM)

### Blocks framed on the sheet
DEBUG LEDS: D4-D10 D12 D13 Q5-Q8 R34-R39 R48 R64-R67 R73 R74
I2C PULL-UP RESISTORS: R40-R45
SHORT I2C BUSES: J6-J8
SHORT I2C BUSES: R2 R6

### Ports
CHRG_OK, GPIO6_PD, GPIO7_PD, GPIO11_PD, I2CM_IRQ, I2CM_SCL, I2CM_SDA, I2CS_IRQ, I2CS_SCL, I2CS_SDA, LDO_3V3, PPHV, SCL_CHRG, SCL_FUEL, SCL_MICRO, SDA_CHRG, SDA_FUEL, SDA_MICRO, V_BUS, V_SYS

### Nets
+3V3: D4.1 D5.1 D6.1 D7.1 D8.1 R40.2 R41.2 R42.2
+5V0: D9.1
GND: J8.1 J8.2 Q5.2(S) Q6.2(S) Q7.2(S) Q8.2(S) R38.1 R39.1 R48.1 R64.1 R65.1 R66.1 R67.1 R73.1 R74.1  [project net FUEL_BATT_SR_N]
ADCIN1: R43.2 R44.2 R45.2 ; port LDO_3V3
CHRG_OK: Q8.1(G) R67.2 ; port CHRG_OK
GPIO2_M: R42.1 ; port I2CS_IRQ
GPIO6_PD: Q5.1(G) R64.2 ; port GPIO6_PD
GPIO7_PD: Q6.1(G) R65.2 ; port GPIO7_PD
GPIO11_PD: Q7.1(G) R66.2 ; port GPIO11_PD
I2CM_IRQ: R45.1 ; port I2CM_IRQ
I2CM_SCL: J7.1 R6.2 R43.1 ; port SCL_CHRG, port I2CM_SCL
I2CM_SDA: J6.1 R2.2 R44.1 ; port SDA_CHRG, port I2CM_SDA
I2CS_SCL: J7.2 R6.1 R40.1 ; port SCL_MICRO, port I2CS_SCL, port SCL_FUEL
I2CS_SDA: J6.2 R2.1 R41.1 ; port SDA_MICRO, port I2CS_SDA, port SDA_FUEL
PPHV: D13.1 ; port PPHV
V_BUS: D12.1 ; port V_BUS
V_SYS: D10.1 ; port V_SYS
NetD4_2: D4.2 R34.2
NetD5_2: D5.2 R35.2
NetD6_2: D6.2 R36.2
NetD7_2: D7.2 R37.2
NetD8_2: D8.2 R38.2
NetD9_2: D9.2 R39.2
NetD10_2: D10.2 R48.2
NetD12_2: D12.2 R73.2
NetD13_2: D13.2 R74.2
NetQ5_3: Q5.3(D) R34.1
NetQ6_3: Q6.3(D) R35.1
NetQ7_3: Q7.3(D) R36.1
NetQ8_3: Q8.3(D) R37.1

### Library data of the parts
D4-D10 D12 D13 = QBLP631-IW5: 0805 LED WHITE, YELLOW DIFFUSED; Manufacturer: QT Brightek (QTB); Configuration: Standard; Current - Test: 5mA; Lens Size: 1.30mm x 1.25mm; Lens Style: Rectangle with Flat Top; Millicandela Rating: 85mcd; Viewing Angle: 140°; Voltage - Forward (Vf) (Typ): 2.9V; Part Number: QBLP631-IW5; Color: White; ComponentLink1Description: Datasheet; ComponentLink1URL: https://www.qt-brightek.com/datasheet/QBLP631-IW5.pdf; ComponentLink2Description: DigiKey Link; ComponentLink2URL: https://www.digikey.com/en/products/detail/qt-brightek-qtb/QBLP631-IW5/16499651; Device Package: 0805 (2012 Metric); Height (Max): 0.90mm; LastUpdated: 9/08/2022 12:43:05 PM; Lens Color: Yellow; Lens Transparency: Diffused; Lifecycle Status: Active; Minimum Order: 1; Mounting Type: Surface Mount; Package / Case: 0805 (2012 Metric); Packaging: TapeAndReel; PartId: 1097; Part Status: Active; Price: 0.08; Series: QBLP631; Size / Dimension: 2.00mm L x 1.25mm W; Supplier 1: DigiKey; Supplier Part Number 1: 1516-QBLP631-IW5CT-ND; Supplier Device Package: 0805; Value: White
J6-J8 = TSM-102-01-L-SV: MF: {'manufacturer': u'Samtec Inc.'}; Value: *; Package: None; Price: None; MP: TSM-102-01-L-SV; Availability: Unavailable
Q5-Q8 = CSD15380F3T: 20-V N-Channel FemtoFET MOSFET 3-PICOSTAR -55 to 150; MF: {'manufacturer': u'Texas Instruments'}; Value: *; Package: None; Price: None; MP: CSD15380F3T; Availability: Unavailable
R2 R6 = CRCW04020000Z0EDHP: RES SMD 0 OHM JUMPER 1/5W 0402; Manufacturer: Vishay Dale; Power (Watts): 0.2W, 1/5W; Part Number: CRCW04020000Z0EDHP; Value: 0 Ohms; ComponentLink1Description: Datasheet; ComponentLink1URL: http://www.vishay.com/docs/20043/crcwhpe3.pdf; ComponentLink2Description: DigiKey Link; ComponentLink2URL: https://www.digikey.com/en/products/detail/vishay-dale/CRCW04020000Z0EDHP/2222496; Composition: Thick Film; Device Package: 0402 (1005 Metric); Features: Automotive AEC-Q200, Pulse Withstanding; Height - Seated (Max): 0.016" (0.40mm); LastUpdated: 7/09/2023 7:26:17 PM; Lifecycle Status: Active; Minimum Order: 1; Number of Terminations: 2; Operating Temperature: -55°C ~ 155°C; Package / Case: 0402 (1005 Metric); Packaging: TapeAndReel; PartId: 3131; Part Status: Active; Price: 0.01; Ratings: AEC-Q200; Resistance: 0 Ohms; Series: CRCW-HP; Size / Dimension: 0.039" L x 0.020" W (1.00mm x 0.50mm); Supplier 1: DigiKey; Supplier Part Number 1: 541-0.0YBCT-ND; Supplier Device Package: 0402; Tolerance: Jumper
R34-R38 = CR0603-JW-103EAS: RES 10K OHM 5% 0.01W 0603; Manufacturer: Bourns Inc.; Temperature Coefficient: ±200ppm/°C; Part Number: CR0603-JW-103EAS; Value: 10 kOhms; ComponentLink1Description: Datasheet; ComponentLink1URL: https://www.bourns.com/docs/Product-Datasheets/CR0603-AS.pdf; ComponentLink2Description: DigiKey Link; ComponentLink2URL: http://digikey.com/product-detail/en/bourns-inc/CR0603-JW-103EAS/CR0603-JW-103EASCT-ND/6830121; Composition: Thick Film; Device Package: 0603 (1608 Metric); Features: Anti-Sulfur; Height - Seated (Max): 0.024" (0.60mm); LastUpdated: 27/04/2023 7:33:47 PM; Lifecycle Status: Active; Minimum Order: 1; Number of Terminations: 2; Operating Temperature: -55°C ~ 155°C; Package / Case: 0603 (1608 Metric); Packaging: CutTape; PartId: 22277; Part Status: Active; Power (Watts): 0.01W; Price: 0.10; Resistance: 10 kOhms; Series: CR0603-AS; Size / Dimension: 0.063" L x 0.031" W (1.60mm x 0.80mm); Supplier 1: DigiKey; Supplier Part Number 1: CR0603-JW-103EASCT-ND; Supplier Device Package: 0603; Tolerance: ±5%
R39 = RC0402FR-1315KL: RES 15K OHM 1% 1/16W 0402; Manufacturer: Yageo; Power (Watts): 0.063W, 1/16W; Temperature Coefficient: ±100ppm/°C; Part Number: RC0402FR-1315KL; Value: 15 kOhms; ComponentLink1Description: Datasheet; ComponentLink1URL: https://www.yageo.com/upload/media/product/productsearch/datasheet/rchip/PYu-RC_Group_51_RoHS_L_11.pdf; ComponentLink2Description: DigiKey Link; ComponentLink2URL: https://www.digikey.com/en/products/detail/yageo/RC0402FR-1315KL/13694190; Composition: Thick Film; Device Package: 0402 (1005 Metric); Features: Moisture Resistant; Height - Seated (Max): 0.016" (0.40mm); LastUpdated: 14/08/2022 9:22:52 PM; Lifecycle Status: Active; Minimum Order: 50000; Number of Terminations: 2; Operating Temperature: -55°C ~ 155°C; Package / Case: 0402 (1005 Metric); PartId: 65094; Part Status: Active; Price: 0; Resistance: 15 kOhms; Series: RC_L; Size / Dimension: 0.039" L x 0.020" W (1.00mm x 0.50mm); Supplier 1: DigiKey; Supplier Part Number 1: 13-RC0402FR-1315KLTR-ND; Supplier Device Package: 0402; Tolerance: ±1%
R40 R41 R43 R44 = RC0402FR-132K2L: RES 2.2K OHM 1% 1/16W 0402; Manufacturer: Yageo; Power (Watts): 0.063W, 1/16W; Temperature Coefficient: ±100ppm/°C; Part Number: RC0402FR-132K2L; Value: 2.2 kOhms; ComponentLink1Description: Datasheet; ComponentLink1URL: https://www.yageo.com/upload/media/product/productsearch/datasheet/rchip/PYu-RC_Group_51_RoHS_L_11.pdf; ComponentLink2Description: DigiKey Link; ComponentLink2URL: https://www.digikey.com/en/products/detail/yageo/RC0402FR-132K2L/13694070; Composition: Thick Film; Device Package: 0402 (1005 Metric); Features: Moisture Resistant; Height - Seated (Max): 0.016" (0.40mm); LastUpdated: 26/04/2023 7:19:35 PM; Lifecycle Status: Active; Minimum Order: 50000; Number of Terminations: 2; Operating Temperature: -55°C ~ 155°C; Package / Case: 0402 (1005 Metric); PartId: 64946; Part Status: Active; Price: 0; Resistance: 2.2 kOhms; Series: RC_L; Size / Dimension: 0.039" L x 0.020" W (1.00mm x 0.50mm); Supplier 1: DigiKey; Supplier Part Number 1: 13-RC0402FR-132K2LTR-ND; Supplier Device Package: 0402; Tolerance: ±1%
R42 R45 = RC0402JR-1310KL: as R61 on sheet Voltage_Regulation_TI; Part Number: RC0402JR-1310KL; Value: 10 kOhms; ComponentLink1Description: Datasheet; ComponentLink1URL: https://www.yageo.com/upload/media/product/productsearch/datasheet/rchip/PYu-RC_Group_51_RoHS_L_11.pdf; ComponentLink2Description: DigiKey Link; ComponentLink2URL: https://www.digikey.com/en/products/detail/yageo/RC0402JR-1310KL/13694115; Composition: Thick Film; Device Package: 0402 (1005 Metric); Features: Moisture Resistant; Height - Seated (Max): 0.016" (0.40mm); LastUpdated: 4/04/2023 7:21:31 PM; Lifecycle Status: Active; Minimum Order: 50000; Number of Terminations: 2; Operating Temperature: -55°C ~ 155°C; Package / Case: 0402 (1005 Metric); PartId: 69237; Part Status: Active; Price: 0; Resistance: 10 kOhms; Series: RC_L; Size / Dimension: 0.039" L x 0.020" W (1.00mm x 0.50mm); Supplier 1: DigiKey; Supplier Part Number 1: 13-RC0402JR-1310KLTR-ND; Supplier Device Package: 0402; Tolerance: ±5%
R48 = RMCF0603FT22K1: RES 22.1K OHM 1% 1/10W 0603; Manufacturer: Stackpole Electronics Inc; Power (Watts): 0.1W, 1/10W; Temperature Coefficient: ±100ppm/°C; Part Number: RMCF0603FT22K1; Value: 22.1 kOhms; ComponentLink1Description: Datasheet; ComponentLink1URL: https://www.seielect.com/catalog/sei-rmcf_rmcp.pdf; ComponentLink2Description: DigiKey Link; ComponentLink2URL: https://www.digikey.com/en/products/detail/stackpole-electronics-inc/RMCF0603FT22K1/1760764; Composition: Thick Film; Device Package: 0603 (1608 Metric); Features: Automotive AEC-Q200; Height - Seated (Max): 0.022" (0.55mm); LastUpdated: 10/05/2023 7:38:01 PM; Lifecycle Status: Active; Minimum Order: 1; Number of Terminations: 2; Operating Temperature: -55°C ~ 155°C; Package / Case: 0603 (1608 Metric); Packaging: CutTape; PartId: 6076; Part Status: Active; Price: 0.01; Ratings: AEC-Q200; Resistance: 22.1 kOhms; Series: RMCF; Size / Dimension: 0.061" L x 0.031" W (1.55mm x 0.80mm); Supplier 1: DigiKey; Supplier Part Number 1: RMCF0603FT22K1CT-ND; Supplier Device Package: 0603; Tolerance: ±1%
R64-R67 = RT0402FRE07100KL: RES SMD 100K OHM 1% 1/16W 0402; Manufacturer: Yageo; Power (Watts): 0.063W, 1/16W; Temperature Coefficient: ±50ppm/°C; Part Number: RT0402FRE07100KL; Value: 100 kOhms; ComponentLink1Description: Datasheet; ComponentLink1URL: https://www.yageo.com/upload/media/product/productsearch/datasheet/rchip/PYu-RT_1-to-0.01_RoHS_L_11.pdf; ComponentLink2Description: DigiKey Link; ComponentLink2URL: https://www.digikey.com/en/products/detail/yageo/RT0402FRE07100KL/1071698; Composition: Thin Film; Device Package: 0402 (1005 Metric); Height - Seated (Max): 0.014" (0.35mm); LastUpdated: 26/04/2023 7:20:40 PM; Lifecycle Status: Active; Minimum Order: 1; Number of Terminations: 2; Operating Temperature: -55°C ~ 155°C; Package / Case: 0402 (1005 Metric); Packaging: TapeAndReel; PartId: 3190; Part Status: Active; Price: 0.01; Resistance: 100 kOhms; Series: RT; Size / Dimension: 0.039" L x 0.020" W (1.00mm x 0.50mm); Supplier 1: DigiKey; Supplier Part Number 1: YAG2307CT-ND; Supplier Device Package: 0402; Tolerance: ±1%
R73 R74 = CRCW060360K4FKEA: RES SMD 60.4K OHM 1% 1/10W 0603; Manufacturer: Vishay Dale; Power (Watts): 0.1W, 1/10W; Temperature Coefficient: ±100ppm/°C; Part Number: CRCW060360K4FKEA; Value: 60.4 kOhms; ComponentLink1Description: Datasheet; ComponentLink1URL: http://www.vishay.com/docs/20035/dcrcwe3.pdf; ComponentLink2Description: DigiKey Link; ComponentLink2URL: https://www.digikey.com/en/products/detail/vishay-dale/CRCW060360K4FKEA/1174871; Composition: Thick Film; Device Package: 0603 (1608 Metric); Features: Automotive AEC-Q200; Height - Seated (Max): 0.020" (0.50mm); LastUpdated: 7/05/2023 7:36:13 PM; Lifecycle Status: Active; Minimum Order: 1; Number of Terminations: 2; Operating Temperature: -55°C ~ 155°C; Package / Case: 0603 (1608 Metric); Packaging: CutTape; PartId: 5182; Part Status: Active; Price: 0.01; Ratings: AEC-Q200; Resistance: 60.4 kOhms; Series: CRCW; Size / Dimension: 0.061" L x 0.033" W (1.55mm x 0.85mm); Supplier 1: DigiKey; Supplier Part Number 1: 541-60.4KHCT-ND; Supplier Device Package: 0603; Tolerance: ±1%

## Nets that join several sheets
+3V3: Microcontroller (17 pins), PD_Controller_TI (C65.1 U3.38), Charging_TI (R17.1 R20.2 R21.2 R22.2), Fuel_Gauge (C82.2 U10.5 U10.6), Voltage_Regulation_TI (6 pins), I2C (8 pins)
+5V0: PD_Controller_TI (C30.1 U3.34_35), Voltage_Regulation_TI (7 pins), I2C (D9.1)
FUEL_BATT_SR_N: Microcontroller (24 pins), PD_Controller_TI (39 pins), Charging_TI (20 pins), Charging_TI_2 (25 pins), Fuel_Gauge (R13.1 R14.2), Voltage_Regulation_TI (19 pins), I2C (15 pins)
AC_N: Charging_TI (U2.2), Charging_TI_2 (C37.1 C40.2 R33.1)
AC_P: Charging_TI (U2.3), Charging_TI_2 (C37.2 C39.2 R32.1)
ADCIN1: PD_Controller_TI (6 pins), I2C (R43.2 R44.2 R45.2)
ALERT_FUEL: Microcontroller (U1.2), Fuel_Gauge (U10.1)
BTST1: Charging_TI (U2.30), Charging_TI_2 (C35.1)
BTST2: Charging_TI (U2.25), Charging_TI_2 (C36.1)
CHRG_OK: Charging_TI (R21.1 U2.4), I2C (Q8.1 R67.2)
DCONN_N: Microcontroller (IC2.5), PD_Controller_TI (J11.A7 J11.B7 U3.27 U9.2)
DCONN_P: Microcontroller (IC2.4), PD_Controller_TI (J11.A6 J11.B6 U3.26 U9.3)
GPIO1_PD: PD_Controller_TI (U3.6), Charging_TI (R20.1 U2.5)
GPIO2_M: Microcontroller (U1.10), PD_Controller_TI (U3.10), I2C (R42.1)
GPIO5_M: Microcontroller (U1.3), Charging_TI (R22.1 U2.11)
GPIO6_PD: PD_Controller_TI (U3.37), I2C (Q5.1 R64.2)
GPIO7_PD: PD_Controller_TI (U3.36), I2C (Q6.1 R65.2)
GPIO11_PD: PD_Controller_TI (U3.13), I2C (Q7.1 R66.2)
HIDRV1: Charging_TI (U2.31), Charging_TI_2 (Q1.G)
HIDRV2: Charging_TI (U2.24), Charging_TI_2 (Q4.G)
I2CM_IRQ: PD_Controller_TI (U3.18), I2C (R45.1)
I2CM_SCL: PD_Controller_TI (U3.17 U5.6), Charging_TI (U2.13), I2C (J7.1 R6.2 R43.1)
I2CM_SDA: PD_Controller_TI (U3.16 U5.5), Charging_TI (U2.12), I2C (J6.1 R2.2 R44.1)
I2CS_SCL: Microcontroller (U1.17), PD_Controller_TI (U3.9), Fuel_Gauge (U10.13), I2C (J7.2 R6.1 R40.1)
I2CS_SDA: Microcontroller (U1.18), PD_Controller_TI (U3.8), Fuel_Gauge (U10.14), I2C (J6.2 R2.1 R41.1)
LODRV1: Charging_TI (U2.29), Charging_TI_2 (C38.2 Q2.G)
LODRV2: Charging_TI (U2.26), Charging_TI_2 (C41.2 Q3.G)
PPHV: PD_Controller_TI (C58.2 C59.2 C60.1 U3.20_22), Charging_TI (C19.2 U2.1), Charging_TI_2 (10 pins), I2C (D13.1)
SW1: Charging_TI (U2.32), Charging_TI_2 (C35.2 L1.1 Q1.S Q2.D)
SW2: Charging_TI (U2.23), Charging_TI_2 (C36.2 L1.2 Q3.D Q4.S)
V_BATT: Charging_TI (6 pins), Fuel_Gauge (Q9.2 R75.2)
V_BUS: Microcontroller (R7.2), PD_Controller_TI (12 pins), I2C (D12.1)
V_SYS: Charging_TI (5 pins), Charging_TI_2 (11 pins), Voltage_Regulation_TI (7 pins), I2C (D10.1)